# EAGLE design modular-slave (EAGLE 9.3.0)
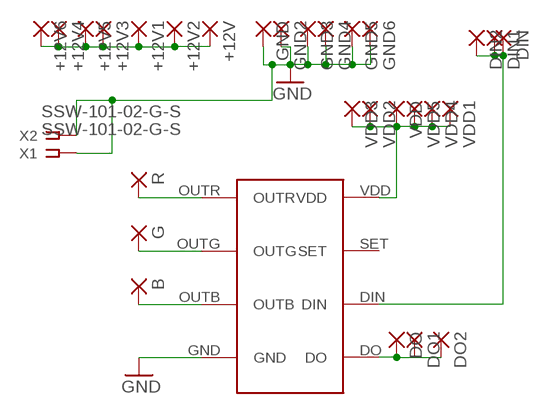
[diagram p0: schematic, sheet 1]

## Parts
0  WS2811  [SOP8]
+12V  SMD5  [SMD2,54-5,08]
+12V1  SMD5  [SMD2,54-5,08]
+12V2  SMD5  [SMD2,54-5,08]
+12V3  SMD5  [SMD2,54-5,08]
+12V4  SMD5  [SMD2,54-5,08]
+12V5  SMD5  [SMD2,54-5,08]
+12V6  SMD5  [SMD2,54-5,08]
B  SMD5  [SMD2,54-5,08]
DIN  SMD5  [SMD2,54-5,08]
DIN1  SMD5  [SMD2,54-5,08]
DIN2  SMD5  [SMD2,54-5,08]
DO  SMD5  [SMD2,54-5,08]
DO1  SMD5  [SMD2,54-5,08]
DO2  SMD5  [SMD2,54-5,08]
G  SMD5  [SMD2,54-5,08]
GND  SMD5  [SMD2,54-5,08]
GND2  SMD5  [SMD2,54-5,08]
GND3  SMD5  [SMD2,54-5,08]
GND4  SMD5  [SMD2,54-5,08]
GND5  SMD5  [SMD2,54-5,08]
GND6  SMD5  [SMD2,54-5,08]
R  SMD5  [SMD2,54-5,08]
VDD  SMD5  [SMD2,54-5,08]
VDD1  SMD5  [SMD2,54-5,08]
VDD2  SMD5  [SMD2,54-5,08]
VDD3  SMD5  [SMD2,54-5,08]
VDD4  SMD5  [SMD2,54-5,08]
VDD5  SMD5  [SMD2,54-5,08]
X1  SSW-101-02-G-S  [SSW-101-02-G-S]
X2  SSW-101-02-G-S  [SSW-101-02-G-S]

## Nets
GND: 0.GND GND2.1(P) GND3.1(P) GND4.1(P) GND5.1(P) GND6.1(P) GND.1(P) X1.1 X2.1
N$2: 0.DO DO1.1(P) DO2.1(P) DO.1(P)
N$3: 0.OUTB B.1(P)
N$4: 0.OUTG G.1(P)
N$5: 0.OUTR R.1(P)
N$7: +12V1.1(P) +12V2.1(P) +12V3.1(P) +12V4.1(P) +12V5.1(P) +12V6.1(P) +12V.1(P)
N$8: 0.VDD VDD1.1(P) VDD2.1(P) VDD3.1(P) VDD4.1(P) VDD5.1(P) VDD.1(P)
N$9: 0.DIN DIN1.1(P) DIN2.1(P) DIN.1(P)
Unconnected: 0.SET

## Library data of the parts
0 = ws2811:WS2811
+12V +12V1-+12V6 B DIN DIN1 DIN2 DO DO1 DO2 G GND GND2-GND6 R VDD VDD1-VDD5 = wirepad:SMD5: SMD PAD
X1 X2 = con-samtec:SSW-101-02-G-S: THROUGH-HOLE .025" SQ POST SOCKET Source: Samtec SSW.pdf; MF: Samtec Inc.; MPN: SSW-101-02-G-S; OC_FARNELL: unknown; OC_NEWARK: 11P9336

## Board
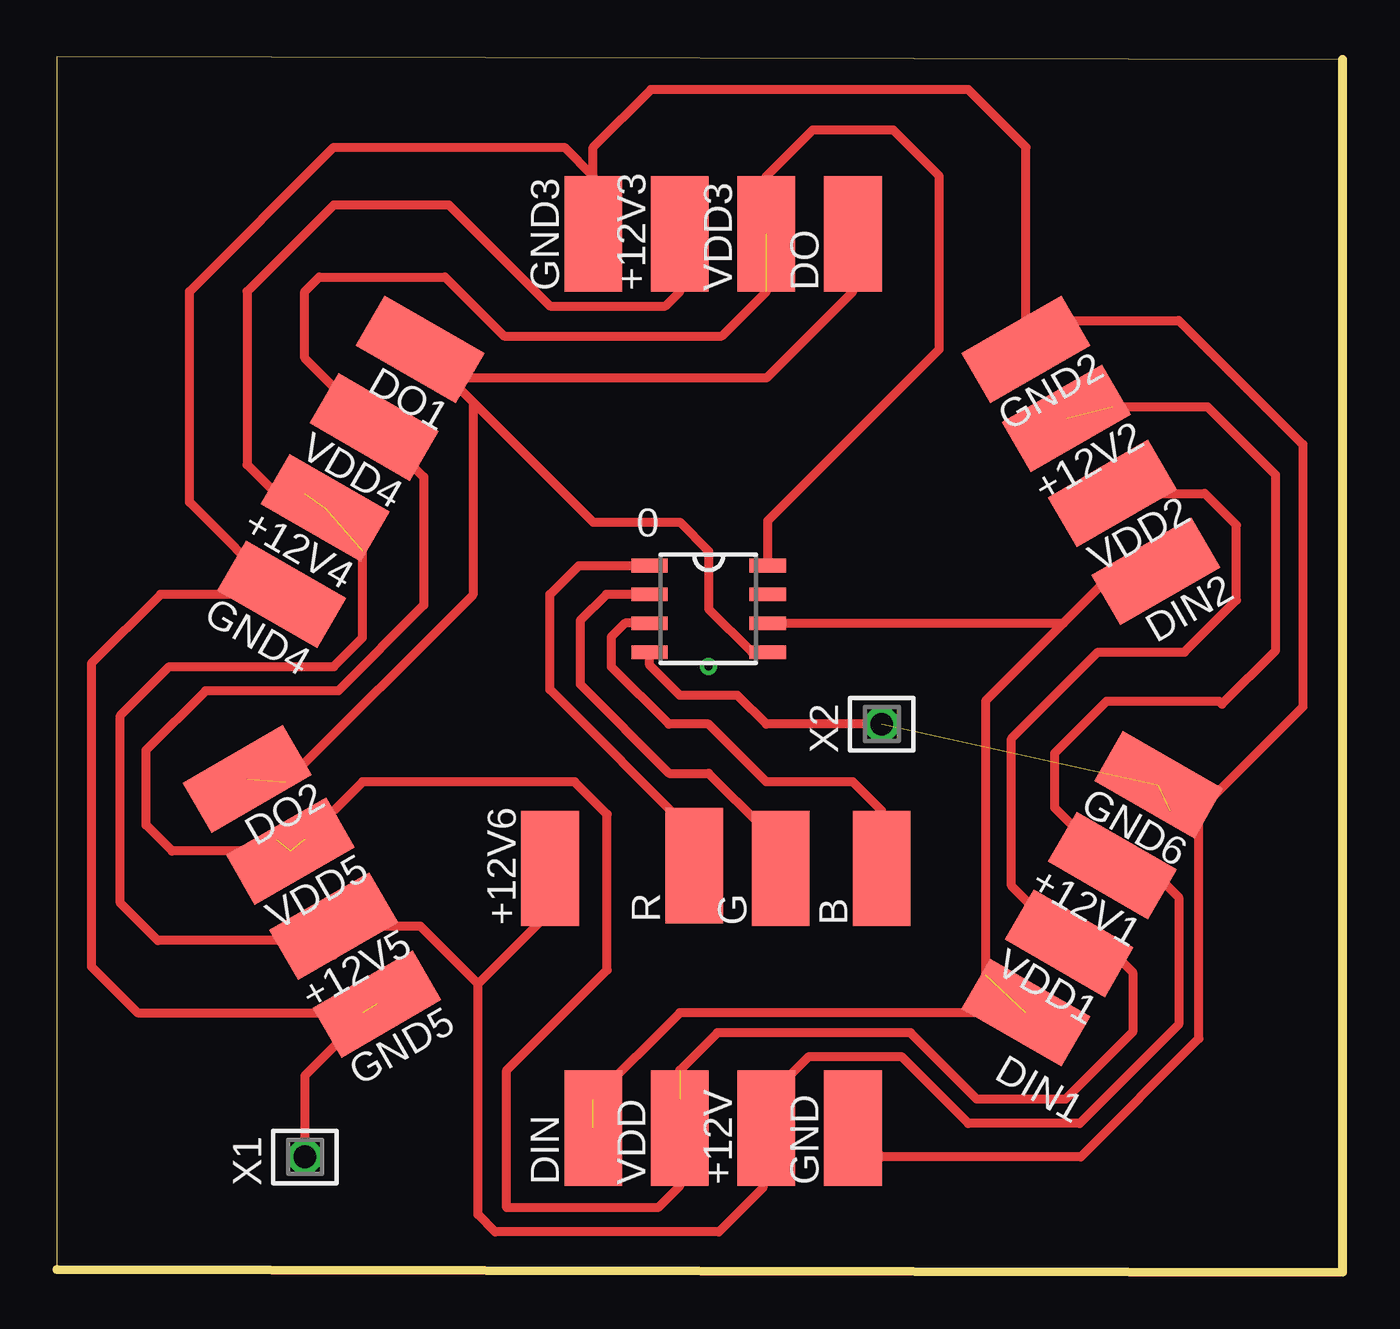
[diagram p1: board, top side]

Size 56.62 x 53.52 mm. Coordinates in mm from the lower left corner, seen from the top.
Outline: 0,0.13 56.62,0 56.62,53.39 0,53.52 0,0.13
Copper layers (1*16): Top 0.035mm / dielectric 1.5mm / Bottom 0.035mm
Design rules "default": minimum track width 6mil, minimum drill 0.35mm, track to track 6mil, track to pad 6mil, pad to pad 6mil, via to via 6mil, smd to smd 6mil, copper to edge 40mil, drill to drill 6mil, minimum pad ring 10mil, minimum via ring 8mil, stop-mask expansion 4mil, vias tented up to drill 0mil, thermal gap 10mil

### Footprints (pad centres in the part's own frame; a part is rotated, then mirrored left to right if it is on the bottom)
SOP8 = smd 0.6 x 1.6: DIN 0.635,2.6; DO 1.905,2.6; GND 1.905,-2.6; OUTB 0.635,-2.6; OUTG -0.635,-2.6; OUTR -1.905,-2.6; SET -0.635,2.6; VDD -1.905,2.6
SMD2,54-5,08 = smd 2.54 x 5.08: 1 0,0
SSW-101-02-G-S = drill 1 pad 1.5 octagon: 1 0,0

### Placement (x,y rotation side)
0  28.7,29.21 270 top
+12V  31.24,6.35 0 top
+12V1  46.48,17.91 60 top
+12V2  44.45,37.59 120 top
+12V3  27.43,45.72 0 top
+12V4  11.81,33.66 60 top
+12V5  12.19,15.24 120 top
+12V6  21.72,17.78 0 top
B  36.32,17.78 0 top
DIN  23.62,6.35 0 top
DIN1  42.67,11.43 60 top
DIN2  48.39,30.86 120 top
DO  35.05,45.72 0 top
DO1  16,40.64 60 top
DO2  8.38,21.72 120 top
G  31.88,17.78 0 top
GND  35.05,6.35 0 top
GND2  42.67,40.64 120 top
GND3  23.62,45.72 0 top
GND4  9.91,29.85 60 top
GND5  14.1,11.81 120 top
GND6  48.51,21.46 60 top
R  28.07,17.91 0 top
VDD  27.43,6.35 0 top
VDD1  44.58,14.48 60 top
VDD2  46.48,34.29 120 top
VDD3  31.24,45.72 0 top
VDD4  13.97,37.21 60 top
VDD5  10.29,18.54 120 top
X1  10.92,5.08 0 top
X2  36.32,24.13 0 top

### Tracks (layer width: path | path; a pad name or v marks a point on that pad's centre or on a via)
GND  (3 unrouted)
  Top 0.152: GND3.1 23.62,46.99
  Top 0.406: 13.46,11.43 3.56,11.43 1.52,13.46 1.52,26.8 4.57,29.85 GND4.1 5.84,33.91 5.84,43.18 12.19,49.53 22.35,49.53 23.62,48.26 | GND2.1 43.94,41.91 49.4,41.91 54.86,36.45 54.86,24.89 50.29,20.32 | 49.02,20.32 50.29,20.32 | GND.1 36.32,5.08 45.09,5.08 50.29,10.29 50.29,20.32 | 23.62,46.99 23.62,48.26 | 23.62,48.26 23.62,49.53 26.16,52.07 40.13,52.07 42.67,49.53 GND2.1 | GND2.1 42.33,40.64 | GND5.1 10.92,8.64 X1.1 | X2.1 31.24,24.13 29.97,25.4 27.43,25.4 26.1,26.73 0.GND
N$1  (via drill 0.35)
  other vias: 28.7,26.67
N$2  (1 unrouted)
  Top 0.406: DO.1 35.05,43.18 31.24,39.37 17.27,39.37 | 10.08,21.59 18.32,29.83 18.32,38.32 | 18.32,38.32 23.62,33.02 27.43,33.02 28.7,31.75 28.7,29.21 30.61,27.3 0.DO | DO1.1 17.27,39.37 | 17.27,39.37 18.32,38.32
N$3
  Top 0.406: 0.OUTB 25.03,28.57 24.41,27.96 24.41,26.67 26.95,24.13 28.7,24.13 31.24,21.59 35.05,21.59 36.32,20.32 B.1 36.32,18.88
N$4
  Top 0.406: 0.OUTG 24.2,29.85 23.04,28.69 23.04,25.89 26.96,21.97 28.7,21.97 31.12,19.56 31.88,19.56 32.51,18.92 32.51,17.78 G.1
N$5
  Top 0.406: R.1 28.07,19.3 21.72,25.65 21.72,29.85 22.99,31.11 0.OUTR 25.99,31.11
N$7  (3 unrouted)
  Top 0.406: 10.92,34.29 9.65,34.29 8.38,35.56 8.38,43.18 12.19,46.99 17.27,46.99 21.72,42.54 26.8,42.54 27.43,43.18 +12V3.1 | +12V5.1 12.19,13.97 | 13.46,31.75 13.46,27.94 12.19,26.67 4.95,26.67 2.79,24.51 2.79,16.26 4.44,14.6 11.56,14.6 +12V5.1 | +12V5.1 16,15.24 18.54,12.7 | 18.54,12.7 18.54,2.54 19.3,1.78 29.15,1.78 31.09,3.72 31.09,6.2 +12V.1 31.24,7.62 33.12,9.5 37.19,9.5 40.13,6.55 45.05,6.55 49.4,10.91 49.4,16.51 48.01,17.91 +12V1.1 43.94,20.45 43.94,22.86 46.23,25.15 51.18,25.15 51.31,25.02 53.67,27.38 53.67,35.1 50.67,38.1 46.48,38.1 | 18.54,12.7 21.72,15.87 +12V6.1
N$8  (4 unrouted)
  Top 0.406: 31.24,43.18 29.29,41.22 19.69,41.22 17.09,43.81 11.56,43.81 10.92,43.18 10.92,40.26 VDD4.1 16.16,35.02 16.16,29.37 12.39,25.6 6.55,25.6 3.94,22.99 3.94,19.69 5.08,18.54 VDD5.1 | 8.38,17.78 9.65,17.78 9.65,19.05 | VDD2.1 50.55,34.29 51.94,32.89 51.94,29.59 49.66,27.3 45.85,27.3 42.04,23.5 42.04,17.02 VDD1.1 46.1,14.48 47.37,13.21 47.37,10.58 44.41,7.62 40.51,7.62 37.59,10.54 29.08,10.54 27.43,8.89 | 27.43,7.62 VDD.1 27.43,3.81 26.47,2.85 19.81,2.85 19.81,8.89 24.23,13.31 24.23,20.16 22.8,21.59 13.46,21.59 10.92,19.05 | VDD3.1 31.24,48.26 33.27,50.29 36.83,50.29 38.86,48.26 38.86,40.64 31.3,33.08 0.VDD
N$9  (2 unrouted)
  Top 0.406: DIN2.1 46.61,30.86 46.35,30.61 44.32,28.57 | 44.32,28.57 40.89,25.15 40.89,13.08 | DIN1.1 27.43,11.43 23.62,7.62 | 0.DIN 44.32,28.57